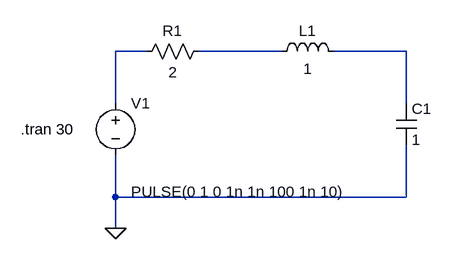
[diagram p0: schematic EXPT_1_PART_1.asc]
EXPT_1_PART_1.asc, the LTspice schematic file:
Version 4
SHEET 1 880 680
WIRE 0 112 -48 112
WIRE 208 112 80 112
WIRE 400 112 288 112
WIRE -48 192 -48 112
WIRE 400 192 400 112
WIRE -48 336 -48 272
WIRE 400 336 400 256
WIRE 400 336 -48 336
WIRE -48 384 -48 336
FLAG -48 384 0
SYMBOL res 96 96 R90
WINDOW 0 0 56 VBottom 2
WINDOW 3 32 56 VTop 2
SYMATTR InstName R1
SYMATTR Value 2
SYMBOL cap 384 192 R0
SYMATTR InstName C1
SYMATTR Value 1
SYMBOL ind 192 128 R270
WINDOW 0 32 56 VTop 2
WINDOW 3 5 56 VBottom 2
SYMATTR InstName L1
SYMATTR Value 1
SYMBOL voltage -48 176 R0
WINDOW 3 24 152 Left 2
WINDOW 123 24 124 Left 2
WINDOW 39 0 0 Left 0
SYMATTR InstName V1
SYMATTR Value PULSE(0 1 0 1n 1n 100 1n 10)
TEXT -194 232 Left 2 !.tran 30

The netlist it stands for:
* EXPT_1_PART_1.asc
R1 N002 N001 2
C1 N003 0 1
L1 N002 N003 1
V1 N001 0 PULSE(0 1 0 1n 1n 100 1n 10)
.tran 30
.backanno
.end